# Altium schematic sheet CPU.SchDoc: Stabilizer
size 420 x 297 mm; Author: G.Kasprowicz; CompanyName: WUT ISE; DrawnBy: G.Kasprowicz; Organization: WUT ISE; Address1: PW ISE; Address2: Nowowiejska 15/19 00-665 Warsaw; Address3: gkasprow@gmail.com; DocumentNumber: 6; Revision: 3.4; SheetNumber: 6; SheetTotal: 11; ModifiedBy: -; CheckedDate: -; Title2: STM32 CPU; DivGrp: WUT ISE; Designer: G.Kasprowicz; ModifiedDate: -; ProjectName: Sensor Box
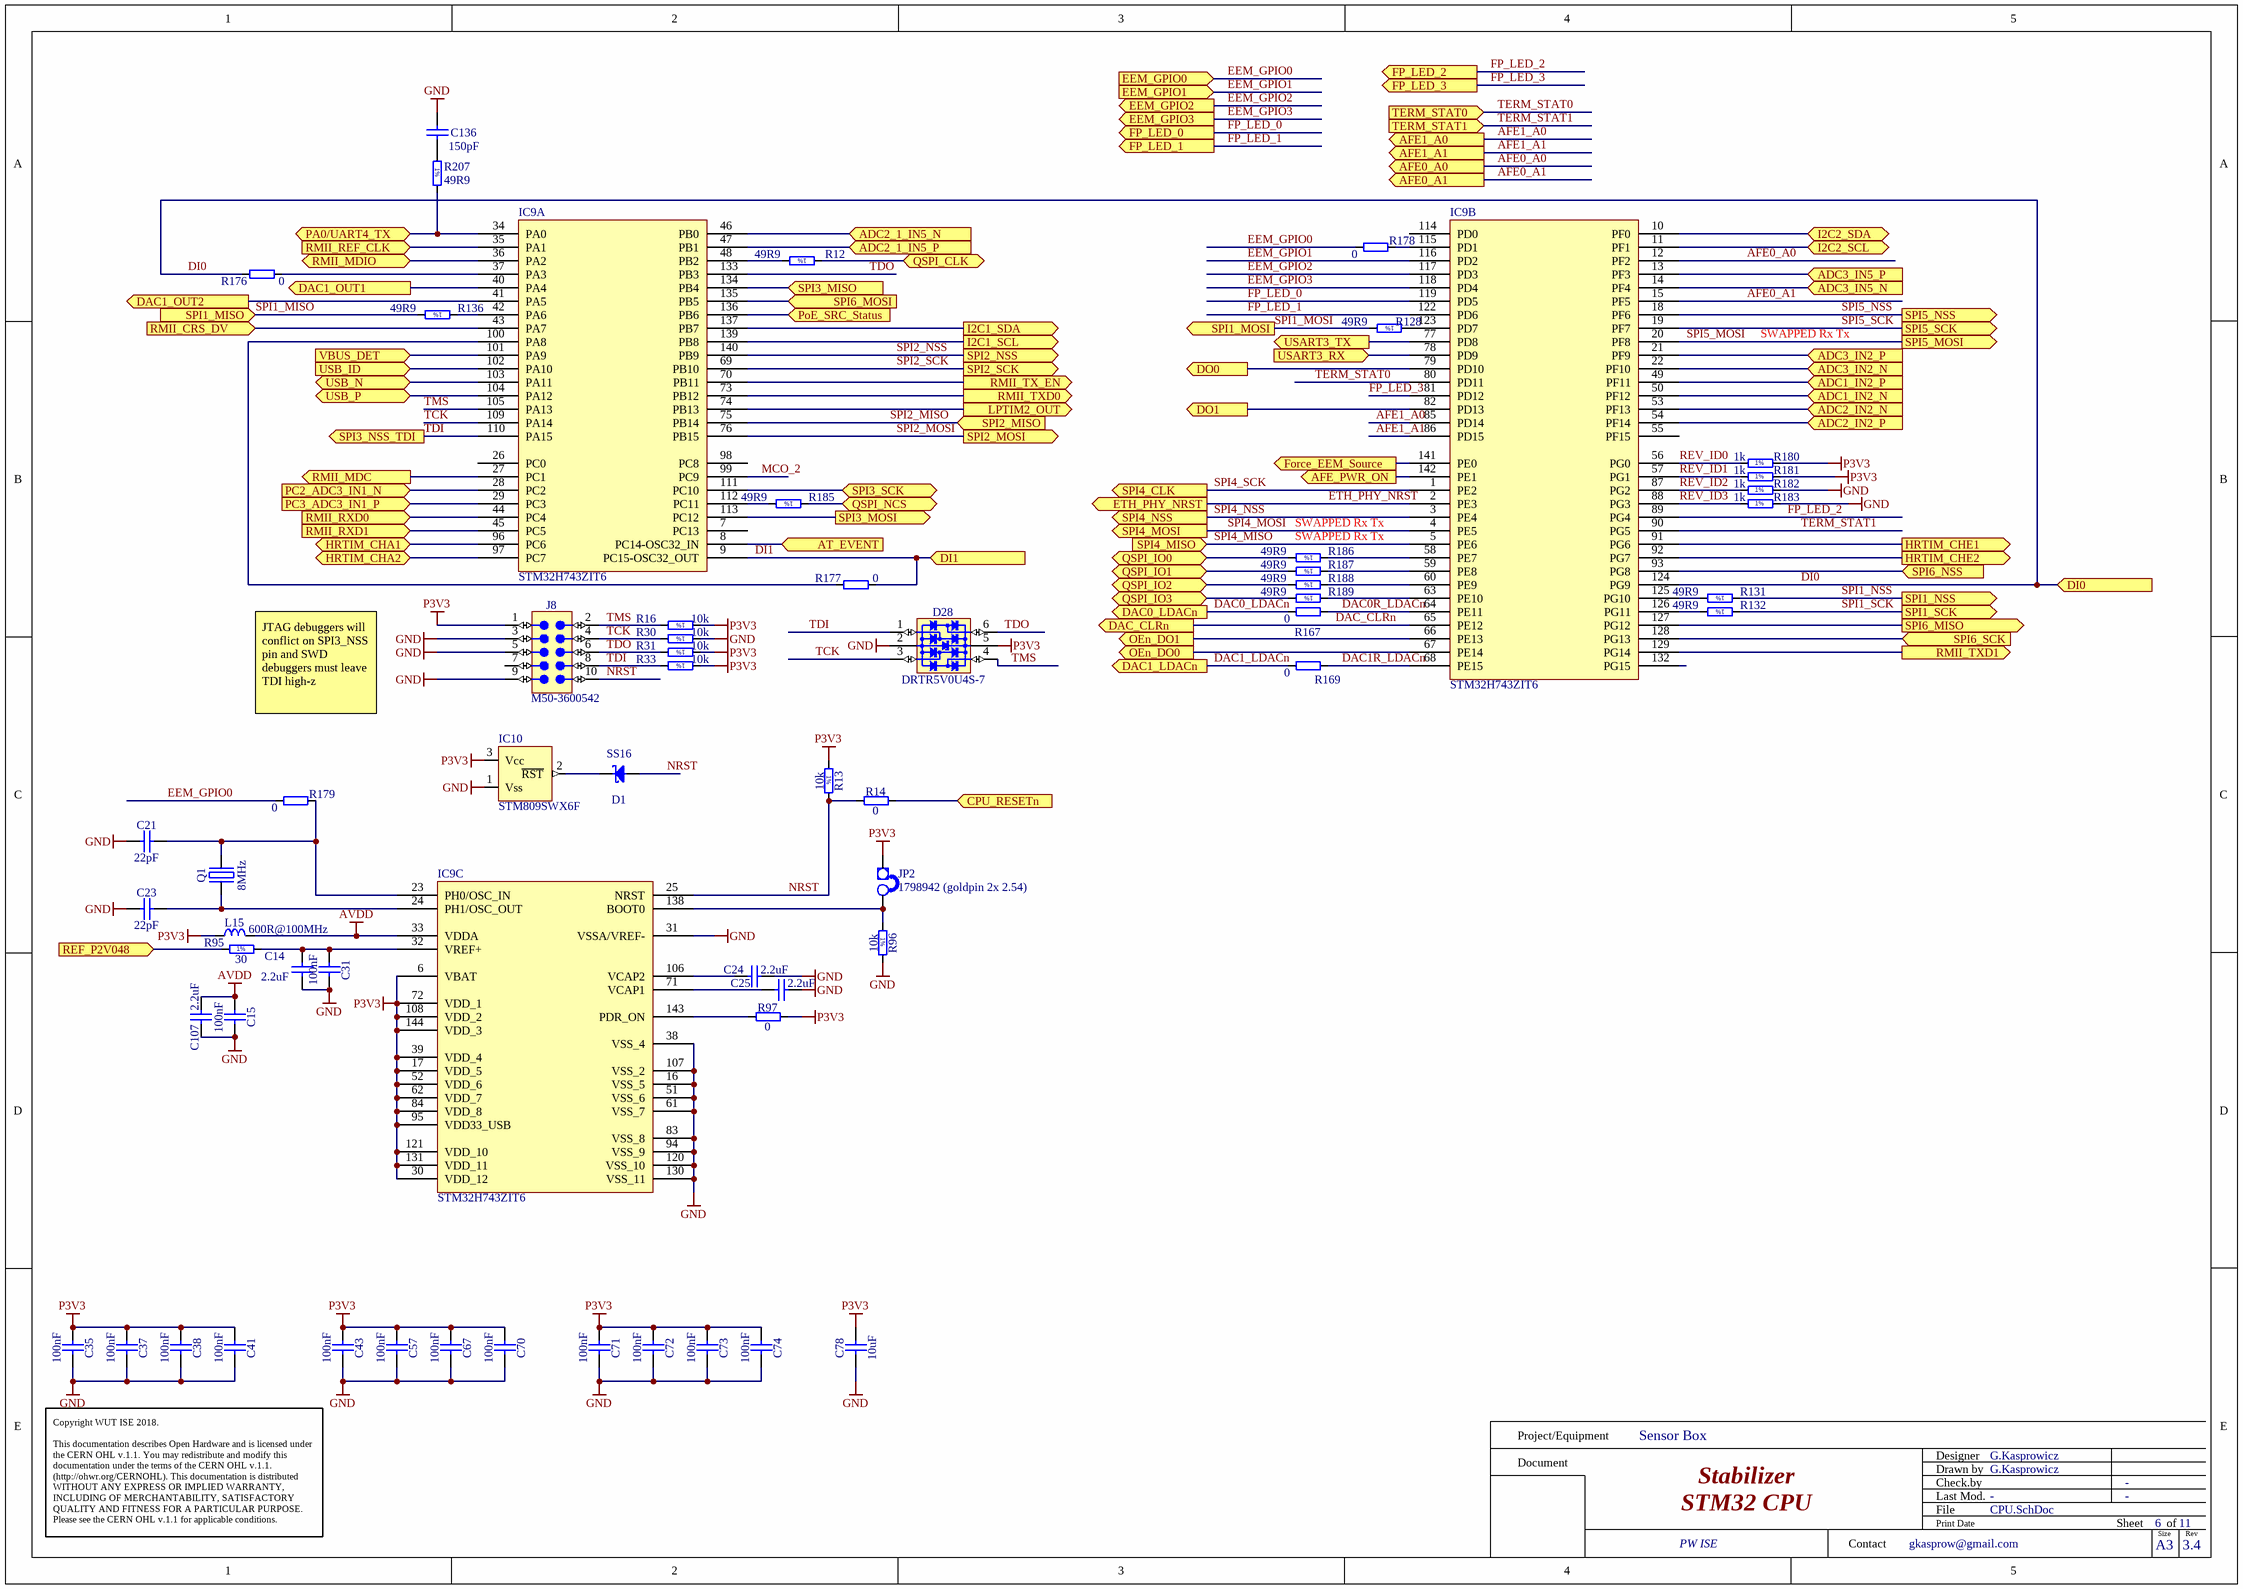
[diagram p0: CPU.SchDoc]

## Parts
C14  2.2uF  [CAPC1608X90N]
C15  100nF  [CAPC1005X55N]
C21  22pF  [CAPC1005X55N]
C23  22pF  [CAPC1005X55N]
C24  2.2uF  [CAPC1608X90N]
C25  2.2uF  [CAPC1608X90N]
C31  100nF  [CAPC1005X55N]
C35  100nF  [CAPC1005X55N]
C37  100nF  [CAPC1005X55N]
C38  100nF  [CAPC1005X55N]
C41  100nF  [CAPC1005X55N]
C43  100nF  [CAPC1005X55N]
C57  100nF  [CAPC1005X55N]
C67  100nF  [CAPC1005X55N]
C70  100nF  [CAPC1005X55N]
C71  100nF  [CAPC1005X55N]
C72  100nF  [CAPC1005X55N]
C73  100nF  [CAPC1005X55N]
C74  100nF  [CAPC1005X55N]
C78  10uF  [CAPC2012X95N]
C107  2.2uF  [CAPC1608X90N]
C136  150pF  [CAPC1608X87N]
D1  SS16  [DIOM5127X229N]
D28  DRTR5V0U4S-7  [SOT65P210X110-6N]
IC9  STM32H743ZIT6  [TSQFP50P2200X2200X160-144N]  (parts A,B,C of 3)
IC10  STM809SWX6F  [SOT-23]
J8  Manufacturer Part Number: M50-3600542  [HARWIN_M50-3600542]  (hidden comment: Header 10)
JP2  1798942 (goldpin 2x 2.54)  [jump]
L15  600R@100MHz  [INDC1005X55N]
Q1  8MHz  [XTAL_TXC_7A]
R12  49R9  [RESC1005X40N]
R13  10k  [RESC1005X40N]
R14  0  [RESC1005X40N]
R16  10k  [RESC1005X40N]
R30  10k  [RESC1005X40N]
R31  10k  [RESC1005X40N]
R33  10k  [RESC1005X40N]
R95  30  [RESC1608X55N]
R96  10k  [RESC1005X40N]
R97  0  [RESC1005X40N]
R128  49R9  [RESC1005X40N]
R131  49R9  [RESC1005X40N]
R132  49R9  [RESC1005X40N]
R136  49R9  [RESC1005X40N]
R167  0  [RESC1608X55N]
R169  0  [RESC1608X55N]
R176  0  [RESC1608X55N]
R177  0  [RESC1608X55N]
R178  0  [RESC1608X55N]
R179  0  [RESC1608X55N]
R180  1k  [RESC1608X55N]
R181  1k  [RESC1608X55N]
R182  1k  [RESC1608X55N]
R183  1k  [RESC1608X55N]
R185  49R9  [RESC1005X40N]
R186  49R9  [RESC1005X40N]
R187  49R9  [RESC1005X40N]
R188  49R9  [RESC1005X40N]
R189  49R9  [RESC1005X40N]
R207  49R9  [RESC1005X40N]

## Ports
ADC1_IN2_N (in), ADC1_IN2_P (in), ADC2_1_IN5_N (in), ADC2_1_IN5_P (in), ADC2_IN2_N (in), ADC2_IN2_P (in), ADC3_IN2_N (in), ADC3_IN2_P (in), ADC3_IN5_N (in), ADC3_IN5_P (in), AFE0_A0 (out), AFE0_A1 (out), AFE1_A0 (out), AFE1_A1 (out), AFE_PWR_ON (out), AT_EVENT (in), CPU_RESETn (in), DAC0_LDACn (out), DAC1_LDACn (out), DAC1_OUT1 (out), DAC1_OUT2 (out), DAC_CLRn (out), DI0 (in), DI1 (in), DO0 (out), DO1 (out), EEM_GPIO0 (in), EEM_GPIO1 (in), EEM_GPIO2 (out), EEM_GPIO3 (out), ETH_PHY_NRST (out), Force_EEM_Source (out), FP_LED_0 (out), FP_LED_1 (out), FP_LED_2 (out), FP_LED_3 (out), HRTIM_CHA1 (bidir), HRTIM_CHA2 (bidir), HRTIM_CHE1 (out), HRTIM_CHE2 (out), I2C1_SCL (out), I2C1_SDA (out), I2C2_SCL (bidir), I2C2_SDA (bidir), LPTIM2_OUT (out), OEn_DO0 (out), OEn_DO1 (out), PA0/UART4_TX (bidir), PC2_ADC3_IN1_N (in), PC3_ADC3_IN1_P (in), PoE_SRC_Status (in), QSPI_CLK (bidir), QSPI_IO0 (bidir), QSPI_IO1 (bidir), QSPI_IO2 (bidir), QSPI_IO3 (bidir), QSPI_NCS (bidir), REF_P2V048 (in), RMII_CRS_DV (in), RMII_MDC (out), RMII_MDIO (bidir), RMII_REF_CLK (in), RMII_RXD0 (in), RMII_RXD1 (in), RMII_TX_EN (out), RMII_TXD0 (out), RMII_TXD1 (out), SPI1_MISO (in), SPI1_MOSI (out), SPI1_NSS (out), SPI1_SCK (out), SPI2_MISO (in), SPI2_MOSI (out), SPI2_NSS (out), SPI2_SCK (out), SPI3_MISO (in), SPI3_MOSI (out), SPI3_NSS_TDI (out), SPI3_SCK (bidir), SPI4_CLK (out), SPI4_MISO (in), SPI4_MOSI (out), SPI4_NSS (out), SPI5_MOSI (out), SPI5_NSS (out), SPI5_SCK (out), SPI6_MISO (out), SPI6_MOSI (in), SPI6_NSS (in), SPI6_SCK (in), TERM_STAT0 (in), TERM_STAT1 (in), USART3_RX (in), USART3_TX (out), USB_ID (in), USB_N (bidir), USB_P (bidir), VBUS_DET (in)

## Nets
AVDD: C15.1 C107.2 IC9.33(VDDA) L15.2
GND: C14.1 C15.2 C21.1 C23.1 C24.2 C25.2 C31.2 C35.2 C37.2 C38.2 C41.2 C43.2 C57.2 C67.2 C70.2 C71.2 C72.2 C73.2 C74.2 C78.1 C107.1 C136.2 D28.2(GND) IC9.16(VSS_5) IC9.31(VSSA/VREF-) IC9.38(VSS_4) IC9.51(VSS_6) IC9.61(VSS_7) IC9.83(VSS_8) IC9.94(VSS_9) IC9.107(VSS_2) IC9.120(VSS_10) IC9.130(VSS_11) IC10.1(Vss) J8.3 J8.5 J8.9 R30.1 R96.2 R182.2 R183.2
P3V3: C35.1 C37.1 C38.1 C41.1 C43.1 C57.1 C67.1 C70.1 C71.1 C72.1 C73.1 C74.1 C78.2 D28.5(VBUS) IC9.6(VBAT) IC9.17(VDD_5) IC9.30(VDD_12) IC9.39(VDD_4) IC9.52(VDD_6) IC9.62(VDD_7) IC9.72(VDD_1) IC9.84(VDD_8) IC9.95(VDD33_USB) IC9.108(VDD_2) IC9.121(VDD_10) IC9.131(VDD_11) IC9.144(VDD_3) IC10.3(Vcc) J8.1 JP2.1(E1) L15.1 R13.1 R16.1 R31.1 R33.1 R97.2 R180.2 R181.2
ADC1_IN2_N: IC9.50(PF12) ; port ADC1_IN2_N
ADC1_IN2_P: IC9.49(PF11) ; port ADC1_IN2_P
ADC2_1_IN5_N: IC9.46(PB0) ; port ADC2_1_IN5_N
ADC2_1_IN5_P: IC9.47(PB1) ; port ADC2_1_IN5_P
ADC2_IN2_N: IC9.53(PF13) ; port ADC2_IN2_N
ADC2_IN2_P: IC9.54(PF14) ; port ADC2_IN2_P
ADC3_IN2_N: IC9.22(PF10) ; port ADC3_IN2_N
ADC3_IN2_P: IC9.21(PF9) ; port ADC3_IN2_P
ADC3_IN5_N: IC9.14(PF4) ; port ADC3_IN5_N
ADC3_IN5_P: IC9.13(PF3) ; port ADC3_IN5_P
AFE0_A0: IC9.12(PF2) ; port AFE0_A0
AFE0_A1: IC9.15(PF5) ; port AFE0_A1
AFE1_A0: IC9.85(PD14) ; port AFE1_A0
AFE1_A1: IC9.86(PD15) ; port AFE1_A1
AFE_PWR_ON: IC9.142(PE1) ; port AFE_PWR_ON
AT_EVENT: IC9.8(PC14-OSC32_IN) ; port AT_EVENT
CPU_RESETn: R14.2 ; port CPU_RESETn
DAC0_LDACn: R167.1 ; port DAC0_LDACn
DAC0R_LDACn: IC9.64(PE11) R167.2
DAC1_LDACn: R169.1 ; port DAC1_LDACn
DAC1_OUT1: IC9.40(PA4) ; port DAC1_OUT1
DAC1_OUT2: IC9.41(PA5) ; port DAC1_OUT2
DAC1R_LDACn: IC9.68(PE15) R169.2
DAC_CLRn: IC9.65(PE12) ; port DAC_CLRn
DI0: IC9.124(PG9) R176.2 ; port DI0
DI1: IC9.9(PC15-OSC32_OUT) R177.1 ; port DI1
DO0: IC9.79(PD10) ; port DO0
DO1: IC9.82(PD13) ; port DO1
EEM_GPIO0: R178.1 R179.1 ; port EEM_GPIO0
EEM_GPIO1: IC9.116(PD2) ; port EEM_GPIO1
EEM_GPIO2: IC9.117(PD3) ; port EEM_GPIO2
EEM_GPIO3: IC9.118(PD4) ; port EEM_GPIO3
ETH_PHY_NRST: IC9.2(PE3) ; port ETH_PHY_NRST
Force_EEM_Source: IC9.141(PE0) ; port Force_EEM_Source
FP_LED_0: IC9.119(PD5) ; port FP_LED_0
FP_LED_1: IC9.122(PD6) ; port FP_LED_1
FP_LED_2: IC9.89(PG4) ; port FP_LED_2
FP_LED_3: IC9.81(PD12) ; port FP_LED_3
HRTIM_CHA1: IC9.96(PC6) ; port HRTIM_CHA1
HRTIM_CHA2: IC9.97(PC7) ; port HRTIM_CHA2
HRTIM_CHE1: IC9.91(PG6) ; port HRTIM_CHE1
HRTIM_CHE2: IC9.92(PG7) ; port HRTIM_CHE2
I2C1_SCL: IC9.139(PB8) ; port I2C1_SCL
I2C1_SDA: IC9.137(PB7) ; port I2C1_SDA
I2C2_SCL: IC9.11(PF1) ; port I2C2_SCL
I2C2_SDA: IC9.10(PF0) ; port I2C2_SDA
LPTIM2_OUT: IC9.74(PB13) ; port LPTIM2_OUT
MCO_2: IC9.99(PC9)
NRST: D1.2(A) IC9.25(NRST) J8.10 R13.2 R14.1
OEn_DO0: IC9.67(PE14) ; port OEn_DO0
OEn_DO1: IC9.66(PE13) ; port OEn_DO1
PA0/UART4_TX: IC9.34(PA0) R207.2 ; port PA0/UART4_TX
PC2_ADC3_IN1_N: IC9.28(PC2) ; port PC2_ADC3_IN1_N
PC3_ADC3_IN1_P: IC9.29(PC3) ; port PC3_ADC3_IN1_P
PoE_SRC_Status: IC9.136(PB6) ; port PoE_SRC_Status
QSPI_CLK: R12.1 ; port QSPI_CLK
QSPI_IO0: R186.2 ; port QSPI_IO0
QSPI_IO1: R187.2 ; port QSPI_IO1
QSPI_IO2: R188.2 ; port QSPI_IO2
QSPI_IO3: R189.2 ; port QSPI_IO3
QSPI_NCS: R185.1 ; port QSPI_NCS
REF_P2V048: R95.1 ; port REF_P2V048
REV_ID0: IC9.56(PG0) R180.1
REV_ID1: IC9.57(PG1) R181.1
REV_ID2: IC9.87(PG2) R182.1
REV_ID3: IC9.88(PG3) R183.1
RMII_CRS_DV: IC9.43(PA7) ; port RMII_CRS_DV
RMII_MDC: IC9.27(PC1) ; port RMII_MDC
RMII_MDIO: IC9.36(PA2) ; port RMII_MDIO
RMII_REF_CLK: IC9.35(PA1) ; port RMII_REF_CLK
RMII_RXD0: IC9.44(PC4) ; port RMII_RXD0
RMII_RXD1: IC9.45(PC5) ; port RMII_RXD1
RMII_TX_EN: IC9.70(PB11) ; port RMII_TX_EN
RMII_TXD0: IC9.73(PB12) ; port RMII_TXD0
RMII_TXD1: IC9.129(PG14) ; port RMII_TXD1
SPI1_MISO: R136.2 ; port SPI1_MISO
SPI1_MOSI: R128.2 ; port SPI1_MOSI
SPI1_NSS: R131.1 ; port SPI1_NSS
SPI1_SCK: R132.1 ; port SPI1_SCK
SPI2_MISO: IC9.75(PB14) ; port SPI2_MISO
SPI2_MOSI: IC9.76(PB15) ; port SPI2_MOSI
SPI2_NSS: IC9.140(PB9) ; port SPI2_NSS
SPI2_SCK: IC9.69(PB10) ; port SPI2_SCK
SPI3_MISO: IC9.134(PB4) ; port SPI3_MISO
SPI3_MOSI: IC9.113(PC12) ; port SPI3_MOSI
SPI3_SCK: IC9.111(PC10) ; port SPI3_SCK
SPI4_MISO: IC9.5(PE6) ; port SPI4_MISO
SPI4_MOSI: IC9.4(PE5) ; port SPI4_MOSI
SPI4_NSS: IC9.3(PE4) ; port SPI4_NSS
SPI4_SCK: IC9.1(PE2) ; port SPI4_CLK
SPI5_MOSI: IC9.20(PF8) ; port SPI5_MOSI
SPI5_NSS: IC9.18(PF6) ; port SPI5_NSS
SPI5_SCK: IC9.19(PF7) ; port SPI5_SCK
SPI6_MISO: IC9.127(PG12) ; port SPI6_MISO
SPI6_MOSI: IC9.135(PB5) ; port SPI6_MOSI
SPI6_NSS: IC9.93(PG8) ; port SPI6_NSS
SPI6_SCK: IC9.128(PG13) ; port SPI6_SCK
TCK: D28.3(I/O2) IC9.109(PA14) J8.4 R30.2
TDI: D28.1(I/O1) IC9.110(PA15) J8.8 R33.2 ; port SPI3_NSS_TDI
TDO: D28.6(I/O4) IC9.133(PB3) J8.6 R31.2
TERM_STAT0: IC9.80(PD11) ; port TERM_STAT0
TERM_STAT1: IC9.90(PG5) ; port TERM_STAT1
TMS: D28.4(I/O3) IC9.105(PA13) J8.2 R16.2
USART3_RX: IC9.78(PD9) ; port USART3_RX
USART3_TX: IC9.77(PD8) ; port USART3_TX
USB_ID: IC9.102(PA10) ; port USB_ID
USB_N: IC9.103(PA11) ; port USB_N
USB_P: IC9.104(PA12) ; port USB_P
VBUS_DET: IC9.101(PA9) ; port VBUS_DET
NetC14_2: C14.2 C31.1 IC9.32(VREF+) R95.2
NetC21_2: C21.2 IC9.23(PH0/OSC_IN) Q1.2(OSC2) R179.2
NetC23_2: C23.2 IC9.24(PH1/OSC_OUT) Q1.1(OSC1)
NetC24_1: C24.1 IC9.106(VCAP2)
NetC25_1: C25.1 IC9.71(VCAP1)
NetC136_1: C136.1 R207.1
NetD1_1: D1.1(C) IC10.2(~{RST})
NetIC9_37: IC9.37(PA3) R176.1
NetIC9_42: IC9.42(PA6) R136.1
NetIC9_48: IC9.48(PB2) R12.2
NetIC9_58: IC9.58(PE7) R186.1
NetIC9_59: IC9.59(PE8) R187.1
NetIC9_60: IC9.60(PE9) R188.1
NetIC9_63: IC9.63(PE10) R189.1
NetIC9_100: IC9.100(PA8) R177.2
NetIC9_112: IC9.112(PC11) R185.2
NetIC9_115: IC9.115(PD1) R178.2
NetIC9_123: IC9.123(PD7) R128.1
NetIC9_125: IC9.125(PG10) R131.2
NetIC9_126: IC9.126(PG11) R132.2
NetIC9_138: IC9.138(BOOT0) JP2.2(E2) R96.1
NetIC9_143: IC9.143(PDR_ON) R97.1

Not connected (* = marked no-connect by the designer): IC9 7(PC13) 26(PC0) 55(PF15) 98(PC8) 114(PD0) 132(PG15); J8 7

## Notes on the sheet
- SWAPPED Rx Tx
- (near R186) SWAPPED Rx Tx
- JTAG debuggers will conflict on SPI3_NSS pin and SWD debuggers must leave TDI high-z
- Project/Equipment
- Document
- Designer
- Drawn by
- Check.by
- Copyright WUT ISE 2018.
  This documentation describes Open Hardware and is licensed under the CERN OHL v.1.1. You may redistribute and modify this documentation under the terms of the CERN OHL v.1.1. (http://ohwr.org/CERNOHL). This documentation is distributed WITHOUT ANY EXPRESS OR IMPLIED WARRANTY, INCLUDING OF MERCHANTABILITY, SATISFACTORY QUALITY AND FITNESS FOR A PARTICULAR PURPOSE. Please see the CERN OHL v.1.1 for applicable conditions.
- Contact
- File
- Last Mod.
- Print Date
- Sheet
- Size
- A3
- of
- Rev
- (in symbol R0402_10K_1%_0.0625W_100PPM) 1%
- (in symbol R0402_49R9_1%_0.0625W_100PPM) 1%
- (in symbol R0603_1K_1%_0.1W_100PPM) 1%
- (in symbol R0603_30R_1%_0.1W_100PPM) 1%

## Library data of the parts
C14 C24 C25 C107 = CC0603_2.2UF_10V_20%_X7R: Non-polarised capacitor; Part Description: SMD Multilayer Chip Ceramic Capacitor; Manufacturer: GENERIC; Manufacturer1 Part Number: LMK107B7225MA-T; Voltage: 10V; TC: X7R; Tolerance: ±20%; Part Number: CC0603_2.2UF_10V_20%_X7R; Component Kind: Standard; Component Type: Standard; Pin Count: 2; Value: 2.2uF; Status: Not Recommended; Manufacturer Part Number: CC0603_2.2UF_10V_20%_X7R; Case: 0603; Mounted: Yes; Socket: No; SMD: Yes; Sense: No; Manufacturer1 Example: TAIYO YUDEN; Manufacturer1 ComponentHeight: 0.9mm; HelpURL: \\cern.ch\dfs\Applications\Altium\Datasheets\CC0603_X7R_TAIYO-YUDEN_HIGH-VALUE.pdf; Author: CERN DEM JLC; CreateDate: 22/06/2011; LatestRevisionDate: 27/06/2011
C15 C31 C35 C37 C38 C41 C43 C57 C67 C70-C74 = CC0402_100NF_16V_10%_X5R: Non-polarised capacitor; Part Description: SMD Multilayer Chip Ceramic Capacitor; Manufacturer: GENERIC; Manufacturer1 Part Number: GRM155R61C104KA88D; Voltage: 16V; TC: X5R; Tolerance: ±10%; Value: 100nF; Part Number: CC0402_100NF_16V_10%_X5R; Component Kind: Standard; Component Type: Standard; Pin Count: 2; Status: None; Manufacturer Part Number: CC0402_100NF_16V_10%_X5R; Case: 0402; Mounted: Yes; Socket: No; SMD: Yes; Sense: No; Manufacturer1 Example: MURATA; Manufacturer1 ComponentHeight: 0.55mm; HelpURL: \\cern.ch\dfs\Applications\Altium\Datasheets\CC0402_X5R_MURATA_GRM.pdf; Author: CERN DEM JLC; CreateDate: 10/12/2013; LatestRevisionDate: 10/12/2013
C21 C23 = CC0402_22PF_50V_5%_C0G: Non-polarised capacitor; Part Description: SMD Multilayer Chip Ceramic Capacitor; Manufacturer: GENERIC; Manufacturer1 Part Number: C0402C220J5GACTU; Voltage: 50V; TC: C0G/NP0; Tolerance: ±5%; Part Number: CC0402_22PF_50V_5%_C0G; Component Kind: Standard; Component Type: Standard; Pin Count: 2; Value: 22pF; Status: Preferred; Manufacturer Part Number: CC0402_22PF_50V_5%_C0G; Case: 0402; Mounted: Yes; Socket: No; SMD: Yes; Sense: No; Manufacturer1 Example: KEMET; Manufacturer1 ComponentHeight: 0.55mm; HelpURL: \\cern.ch\dfs\Applications\Altium\Datasheets\CC0805_C0G_KEMET_(Commercial Grade).pdf; Author: CERN DEM JLC; CreateDate: 03/12/2007; LatestRevisionDate: 03/12/2007
C78 = CC0805_10UF_25V_10%_X5R: Non-polarised capacitor; Part Description: SMD Multilayer Chip Ceramic Capacitor; Manufacturer: GENERIC; Manufacturer1 Part Number: GRM219R61E106KA12D; Voltage: 25V; TC: X5R; Tolerance: ±10%; Part Number: CC0805_10UF_25V_10%_X5R; Component Kind: Standard; Component Type: Standard; Pin Count: 2; Value: 10uF; Status: Preferred; Manufacturer Part Number: CC0805_10UF_25V_10%_X5R; Case: 0805; Mounted: Yes; Socket: No; SMD: Yes; Sense: No; Manufacturer1 Example: MURATA; Manufacturer1 ComponentHeight: 0.95mm; HelpURL: \\cern.ch\dfs\Applications\Altium\Datasheets\CC0805_X5R_MURATA_GRM.pdf; Author: CERN DEM JLC; CreateDate: 25.10.2012; LatestRevisionDate: 06.09.2016
C136 = CC0603_150PF_50V_1%_NP0: Non-polarised capacitor; Part Description: SMD Multilayer Chip Ceramic Capacitor; Manufacturer: GENERIC; Manufacturer1 Part Number: CC0603FRNPO9BN151; Voltage: 50V; TC: C0G/NP0; Tolerance: ±1%; Part Number: CC0603_150PF_50V_1%_NP0; Component Kind: Standard; Component Type: Standard; Pin Count: 2; Value: 150pF; Status: None; Manufacturer Part Number: CC0603_150PF_50V_1%_NP0; Case: 0603; Mounted: Yes; Socket: No; SMD: Yes; Sense: No; Manufacturer1 Example: PHYCOMP; Manufacturer1 ComponentHeight: 0.7mm; HelpURL: \\cern.ch\dfs\Applications\Altium\Datasheets\CC0805_NP0_PHYCOMP_16VTO50V.pdf; Author: CERN DEM MR; CreateDate: 17.02.2016; LatestRevisionDate: 17.02.2016
D1 = SS16: Schottky Diode; Part Description: Surface Mount Schottky Barrier Rectifier; Manufacturer: VISHAY GENERAL SEMICONDUCTOR; Voltage: 60V; Power: 1A; PressFit: No; Bonding: No; Part Number: SS16; Component Kind: Standard; Component Type: Standard; Device: SS16; PackageDescription: DO-214-AC Molded Diode, Body 5.1x2.7mm, IPC Medium Density; Manufacturer Part Number: SS16; Pin Count: 2; Case: DO-214AC; Mounted: Yes; Socket: No; SMD: Yes; Sense: No; ComponentHeight: 2.29mm; HelpURL: \\cern.ch\dfs\Applications\Altium\Datasheets\SS16.pdf; Author: CERN DEM JLC; CreateDate: 15.07.2008; LatestRevisionDate: 23.08.2010
D28 = D_TVS_DRTR5V0U4S-7: Integrated Quad Ultra-Low Capacitance ESD Protection; Part Description: Integrated Quad Ultra-Low Capacitance ESD (±8kV) Protection; Manufacturer: DIODES; PressFit: No; Bonding: No; Status Comment: Active; Part Number: DRTR5V0U4S-7; Component Kind: Standard; Component Type: Standard; Device: DRTR5V0U4S-7; PackageDescription: SOT363, SC70-6, 0.65mm Pitch; 6 Pin, 1.25mm W X 2.00mm L X 1.10mm H body, IPC Medium Density; Status: Active; Manufacturer Part Number: DRTR5V0U4S-7; Pin Count: 6; Case: SOT363; Mounted: Yes; Socket: No; SMD: Yes; Sense: No; ComponentHeight: 1.1mm; HelpURL: \\cern.ch\dfs\Applications\Altium\Datasheets\PRTR5V0U4Y.pdf; Author: GK; CreateDate: 24.01.2017; LatestRevisionDate: 14.09.2020
IC9 = UPC_STM32H743ZIT6: 32-bit Arm® Cortex-M7 400MHz MCUs, up to 2MB Flash, / 1MB RAM, 46 com. and analog interfaces
IC10 = VMON_STM809: 2.93V  Reset circuit
J8 = CON_2x10 1.27 SMT_male_HARWIN: 10 Contacts - Pitch 1.27mm - Dual Row SMT Vertical Pin Header (Post Lead = 3mm, Insulator 1mm); Manufacturer: HARWIN; PressFit: No; Part Number: HARWIN_M50-3600542; Component Kind: Standard; Component Type: Standard; Pin Count: 10; Family: Header 10; Mounted: Yes; Socket: No; SMD: Yes; Sense: No; Status: None; Part Description: 10 Contacts - Pitch 1.27mm - Dual Row SMT Vertical Pin Header (Post Lead = 3mm, Insulator 1mm); ComponentHeight: 5.13mm; HelpURL: \\cern.ch\dfs\Applications\Altium\Datasheets\HARWIN_M50-3600842.pdf; Author: GK; CreateDate: 15.03.2017; LatestRevisionDate: 22.05.2017
JP2 = JUMPER: Supplier 1: Farnell; Supplier Part Number 1: 1798942
L15 = IND0402_MURATA_BLM15HD601SN1: Inductor; Part Description: SMD EMIFIL Suppression Chip Ferrite Bead; Manufacturer: MURATA; Manufacturer Part Number: BLM15HD601SN1D; Power: 300mA; Resistance: 0.85R; Tolerance: ±25%; Part Number: IND0402_MURATA_BLM15HD601SN1; Component Kind: Standard; Component Type: Standard; Pin Count: 2; Value: 600R@100MHz; Status: None; Case: 0402; Mounted: Yes; Socket: No; SMD: Yes; Sense: No; ComponentHeight: 0.55mm; HelpURL: \\cern.ch\dfs\Applications\Altium\Datasheets\IND0402_MURATA_BLM15H.pdf; Author: CERN DEM JLC; CreateDate: 28/02/2012; LatestRevisionDate: 28/02/2012
Q1 = XTAL_8MHZ_TXC_7A-8.000MAAE-T: Quartz Crystal; Part Description: Tolerance: ±30ppm, Stability: ±30ppm, -20°C to +70°C, 12pF, SMD Glass Seam Sealing Crystal, 7A Series; Manufacturer: TXC CORPORATION; PressFit: No; Bonding: No; Part Number: XTAL_8MHZ_TXC_7A-8.000MAAE-T; Component Kind: Standard; Component Type: Standard; PackageDescription: 2 Pins, 3.2x5mm, SMD Glass Seam Sealing Crystal, 7A Serie; Value: 8MHz; Manufacturer Part Number: 7A-8.000MAAE-T; Pin Count: 2; Mounted: Yes; Socket: No; SMD: Yes; Sense: No; ComponentHeight: 1.2mm; HelpURL: \\cern.ch\dfs\Applications\Altium\Datasheets\XTAL_TXC_7A.pdf; Author: CERN DEM JLC; CreateDate: 09/10/2014; LatestRevisionDate: 12/11/2014
R12 R128 R131 R132 R136 R185-R189 R207 = R0402_49R9_1%_0.0625W_100PPM: Resistor - 1%; Part Description: General Purpose Thick Film Chip Resistor; Manufacturer: GENERIC; Manufacturer1 Part Number: 232270674999L or RC0402FR-0749R9L; TC: ±100ppm/°C; Table: Resistors SMD; Part Number: R0402_49R9_1%_0.0625W_100PPM; Component Kind: Standard; Component Type: Standard; Pin Count: 2; Value: 49R9; Status: Not recommended; Power: 0.0625W; Tolerance: ±1%; Manufacturer Part Number: R0402_49R9_1%_0.0625W_100PPM; Case: 0402; Mounted: Yes; Socket: No; SMD: Yes; Manufacturer1 Example: YAGEO PHYCOMP; Manufacturer1 ComponentHeight: 0.4mm; HelpURL: \\cern.ch\dfs\Applications\Altium\Datasheets\R0402_Phycomp_RC0402.pdf; Author: CERN DEM JLC; CreateDate: 2012-10-24; LatestRevisionDate: 2012-10-24
R13 R96 = R0402_10K_1%_0.0625W_100PPM: Resistor - 1%; Part Description: General Purpose Thick Film Chip Resistor; Manufacturer: GENERIC; Manufacturer1 Part Number: 232270671003L; TC: ±100ppm/°C; PressFit: No; Value: 10k; Part Number: R0402_10K_1%_0.0625W_100PPM; Component Kind: Standard; Component Type: Standard; Pin Count: 2; Status: Not Recommended; Power: 0.0625W; Tolerance: ±1%; Manufacturer Part Number: R0402_10K_1%_0.0625W_100PPM; Case: 0402; Mounted: Yes; Sense: No; Socket: No; SMD: Yes; Manufacturer1 Example: YAGEO PHYCOMP; Manufacturer1 ComponentHeight: 0.4mm; HelpURL: \\cern.ch\dfs\Applications\Altium\Datasheets\R0402_Phycomp_RC0402.pdf; Author: CERN DEM JLC; CreateDate: 03/12/2007; LatestRevisionDate: 17/10/2012
R14 R97 = R0402_0R_JUMPER: Resistor; Part Description: 1A (0.05R Max DC Resistance) Zero Ohm Jumper; Manufacturer: GENERIC; Manufacturer1 Part Number: 232270591001L; PressFit: No; Part Number: R0402_0R_JUMPER; Component Kind: Standard; Component Type: Standard; Pin Count: 2; Value: 0; Status: Not Recommended; Manufacturer Part Number: R0402_0R_JUMPER; Case: 0402; Mounted: Yes; Sense: No; Socket: No; SMD: Yes; Manufacturer1 Example: YAGEO PHYCOMP; Manufacturer1 ComponentHeight: 0.4mm; HelpURL: \\cern.ch\dfs\Applications\Altium\Datasheets\R0402_Phycomp_RC0402.pdf; Author: CERN DEM JLC; CreateDate: 03/12/2007; LatestRevisionDate: 17/10/2012
R16 R30 R31 R33 = R0402_10K_1%_0.0625W_100PPM: Resistor - 1%; Part Description: General Purpose Thick Film Chip Resistor; Manufacturer: GENERIC; Manufacturer1 Part Number: 232270671003L; TC: ±100ppm/°C; Table: Resistors SMD; Part Number: R0402_10K_1%_0.0625W_100PPM; Component Kind: Standard; Component Type: Standard; Pin Count: 2; Value: 10k; Status: Not recommended; Power: 0.0625W; Tolerance: ±1%; Manufacturer Part Number: R0402_10K_1%_0.0625W_100PPM; Case: 0402; Mounted: Yes; Socket: No; SMD: Yes; Manufacturer1 Example: YAGEO PHYCOMP; Manufacturer1 ComponentHeight: 0.4mm; HelpURL: \\cern.ch\dfs\Applications\Altium\Datasheets\R0402_Phycomp_RC0402.pdf; Author: CERN DEM JLC; CreateDate: 2007-12-03; LatestRevisionDate: 2012-10-17
R95 = R0603_30R_1%_0.1W_100PPM: Resistor - 1%; Part Description: General Purpose Thick Film Chip Resistor; Manufacturer: GENERIC; Manufacturer1 Part Number: NRC06F30R0TRF; Power: 0.1W; TC: ±100ppm/°C; PressFit: No; Part Number: R0603_30R_1%_0.1W_100PPM; Component Kind: Standard; Component Type: Standard; Pin Count: 2; Value: 30; Status: Preferred; Tolerance: ±1%; Manufacturer Part Number: R0603_30R_1%_0.1W_100PPM; Case: 0603; Mounted: Yes; Sense: No; Socket: No; SMD: Yes; Manufacturer1 Example: NIC COMPONENT; Manufacturer1 ComponentHeight: 0.55mm; HelpURL: \\cern.ch\dfs\Applications\Altium\Datasheets\R0603_NIC_NRC.pdf; Author: CERN DEM JLC; CreateDate: 03.12.2007; LatestRevisionDate: 13.03.2008
R167 R169 R176-R179 = R0603_0R_JUMPER: Resistor; Part Description: 1A (0.05R Max DC Resistance) Zero Ohm Jumper; Manufacturer: GENERIC; Manufacturer1 Part Number: NRC06Z0; PressFit: No; Part Number: R0603_0R_JUMPER; Component Kind: Standard; Component Type: Standard; Pin Count: 2; Value: 0; Status: Preferred; Manufacturer Part Number: R0603_0R_JUMPER; Case: 0603; Mounted: Yes; Sense: No; Socket: No; SMD: Yes; Manufacturer1 Example: NIC COMPONENT; Manufacturer1 ComponentHeight: 0.55mm; HelpURL: \\cern.ch\dfs\Applications\Altium\Datasheets\R0603_NIC_NRC.pdf; Author: CERN DEM JLC; CreateDate: 03.12.2007; LatestRevisionDate: 13.03.2008
R180-R183 = R0603_1K_1%_0.1W_100PPM: Resistor - 1%; Part Description: General Purpose Thick Film Chip Resistor; Manufacturer: GENERIC; Manufacturer1 Part Number: NRC06F1001TRF; Power: 0.1W; TC: ±100ppm/°C; PressFit: No; Part Number: R0603_1K_1%_0.1W_100PPM; Component Kind: Standard; Component Type: Standard; Pin Count: 2; Value: 1k; Status: Preferred; Tolerance: ±1%; Manufacturer Part Number: R0603_1K_1%_0.1W_100PPM; Case: 0603; Mounted: Yes; Sense: No; Socket: No; SMD: Yes; Manufacturer1 Example: NIC COMPONENT; Manufacturer1 ComponentHeight: 0.55mm; HelpURL: \\cern.ch\dfs\Applications\Altium\Datasheets\R0603_NIC_NRC.pdf; Author: CERN DEM JLC; CreateDate: 03/12/2007; LatestRevisionDate: 13/03/2008